# EAGLE design arduino_Uno_shield_bora_lora (EAGLE 7.4.0)
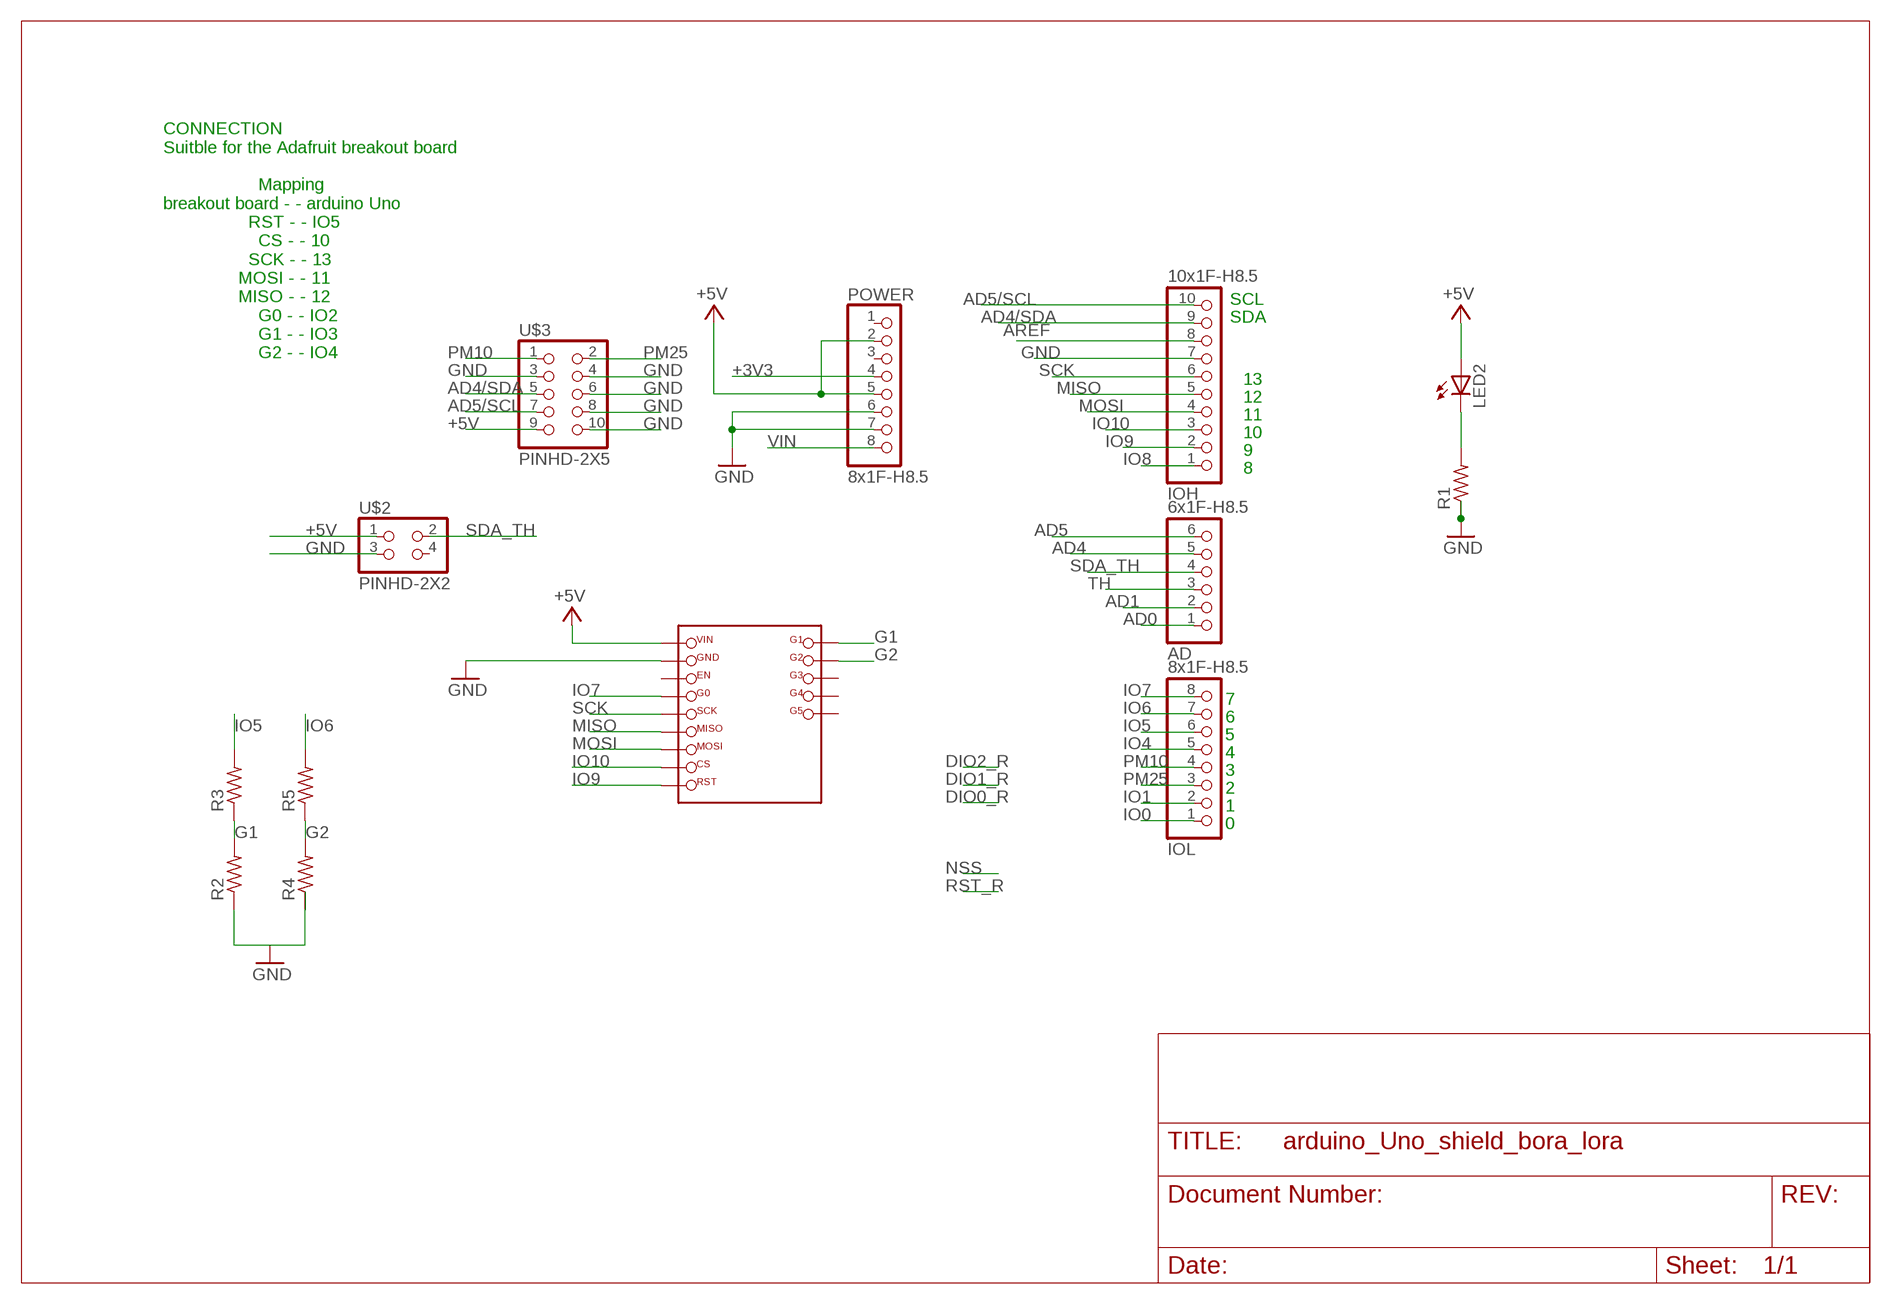
[diagram p0: schematic, sheet 1]

## Parts
AD  6x1F-H8.5  PINHD-1X6  [1X06]
IOH  10x1F-H8.5  PINHD-1X10_ARD  [1X10]
IOL  8x1F-H8.5  PINHD-1X8  [1X08]
LED2  LED3MM  [LED3MM]
POWER  8x1F-H8.5  PINHD-1X8  [1X08]
R1  RESISTOR1206  [1206]
R2  RESISTOR1206  [1206]
R3  RESISTOR1206  [1206]
R4  RESISTOR1206  [1206]
R5  RESISTOR1206  [1206]
U$1  RFM95W_ADAFRUIT  [RFM95W_ADAFRUIT]
U$2  PINHD-2X2  [2X2]
U$3  PINHD-2X5  [2X5]

## Nets
+3V3: POWER.4
+5V [usbvcc]: LED2.A POWER.2 POWER.5 U$1.VIN U$2.1 U$3.9
AD0: AD.1
AD1: AD.2
AD4: AD.5
AD4/SDA: IOH.9 U$3.5
AD5: AD.6
AD5/SCL: IOH.10 U$3.7
AREF [aref]: IOH.8
G1: R2.2 R3.1 U$1.G1
G2: R4.2 R5.1 U$1.G2
GND [gnd]: IOH.7 POWER.6 POWER.7 R1.1 R2.1 R4.1 U$1.GND U$2.3 U$3.3 U$3.4 U$3.6 U$3.8 U$3.10
IO0: IOL.1
IO1: IOL.2
IO4: IOL.5
IO5: IOL.6 R3.2
IO6: IOL.7 R5.2
IO7: IOL.8 U$1.G0
IO8: IOH.1
IO9: IOH.2 U$1.RST
IO10: IOH.3 U$1.CS
MISO: IOH.5 U$1.MISO
MOSI: IOH.4 U$1.MOSI
N$1: LED2.K(C) R1.2
PM10: IOL.4 U$3.1
PM25: IOL.3 U$3.2
SCK: IOH.6 U$1.SCK
SDA_TH: AD.4 U$2.2
TH: AD.3
VIN [power]: POWER.8
Unconnected: POWER.1 POWER.3 U$1.EN U$1.G3 U$1.G4 U$1.G5 U$2.4

## Notes on the sheet
- SCL
- SDA
- CONNECTION
  Suitble for the Adafruit breakout board
  
                     Mapping
  breakout board - - arduino Uno
                   RST - - IO5
                     CS - - 10 
                   SCK - - 13
                 MOSI - - 11
                 MISO - - 12
                     G0 - - IO2 
                     G1 - - IO3 
                     G2 - - IO4
- 13
- 12
- 11
- 10
- 9
- 8
- 7
- 6
- 5
- 4
- 3
- 2
- 1
- 0

## Library data of the parts
AD = SmartPrj:PINHD-1X6: PIN HEADER
IOH = SmartPrj:PINHD-1X10_ARD: PIN HEADER
IOL POWER = SmartPrj:PINHD-1X8: PIN HEADER
LED2 = led:LED: LED OSRAM: - CHIPLED LG R971, LG N971, LY N971, LG Q971, LY Q971, LO R971, LY R971 LH N974, LH R974 LS Q976, LO Q976, LY Q976 LO Q996 - Hyper CHIPLED LW Q18S LB Q993, LB Q99A, LB R99A - SideLED LS A670, LO A670, LY A670, LG A670, LP A670 LB A673, LV A673, LT A673, LW A673 LH A674 LY A675 LS A676, LA A676, LO A676, LY A676, LW A676 LS A679, LY A679, LG A679 - Hyper Micro SIDELED® LS Y876, LA Y876, LO Y876, LY Y876 LT Y87S - SmartLED LW L88C, LW L88S LB L89C, LB L89S, LG L890 LS L89K, LO L89K, LY L89K LS L896, LA L896, LO L896, LY L896 - TOPLED LS T670, LO T670, LY T670, LG T670, LP T670 LSG T670, LSP T670, LSY T670, LOP T670, LYG T670 LG T671, LOG T671, LSG T671 LB T673, LV T673, LT T673, LW T673 LH T674 LS T676, LA T676, LO T676, LY T676, LB T676, LH T676, LSB T676, LW T676 LB T67C, LV T67C, LT T67C, LS T67K, LO T67K, LY T67K, LW E67C LS E67B, LA E67B, LO E67B, LY E67B, LB E67C, LV E67C, LT E67C LW T67C LS T679, LY T679, LG T679 LS T770, LO T770, LY T770, LG T770, LP T770 LB T773, LV T773, LT T773, LW T773 LH T774 LS E675, LA E675, LY E675, LS T675 LS T776, LA T776, LO T776, LY T776, LB T776 LHGB T686 LT T68C, LB T68C - Hyper Mini TOPLED® LB M676 - Mini TOPLED Santana® LG M470 LS M47K, LO M47K, LY M47K Source: http://www.osram.convergy.de LUXEON: - LUMILED® LXK2-PW12-R00, LXK2-PW12-S00, LXK2-PW14-U00, LXK2-PW14-V00 LXK2-PM12-R00, LXK2-PM12-S00, LXK2-PM14-U00 LXK2-PE12-Q00, LXK2-PE12-R00, LXK2-PE12-S00, LXK2-PE14-T00, LXK2-PE14-U00 LXK2-PB12-K00, LXK2-PB12-L00, LXK2-PB12-M00, LXK2-PB14-N00, LXK2-PB14-P00, LXK2-PB14-Q00 LXK2-PR12-L00, LXK2-PR12-M00, LXK2-PR14-Q00, LXK2-PR14-R00 LXK2-PD12-Q00, LXK2-PD12-R00, LXK2-PD12-S00 LXK2-PH12-R00, LXK2-PH12-S00 LXK2-PL12-P00, LXK2-PL12-Q00, LXK2-PL12-R00 Source: www.luxeon.com KINGBRIGHT: KA-3528ASYC Source: www.kingbright.com
R1-R5 = ng:RESISTOR
U$1 = ep:RFM95W_ADAFRUIT
U$2 = ep:PINHD-2X2
U$3 = ep:PINHD-2X5

## Net classes
0 default: width 0.4 mm, drill 0.8 mm, clearance 0.8 mm
1 power: width 0.8 mm, drill 0.8 mm, clearance 0.8 mm
2 gnd: width 0.8 mm, drill 0.8 mm, clearance 0.8 mm
3 usbvcc: width 0.508 mm, drill 0.61 mm, clearance 0.254 mm
4 aref: width 0.406 mm, drill 0.61 mm, clearance 0.254 mm

## Board
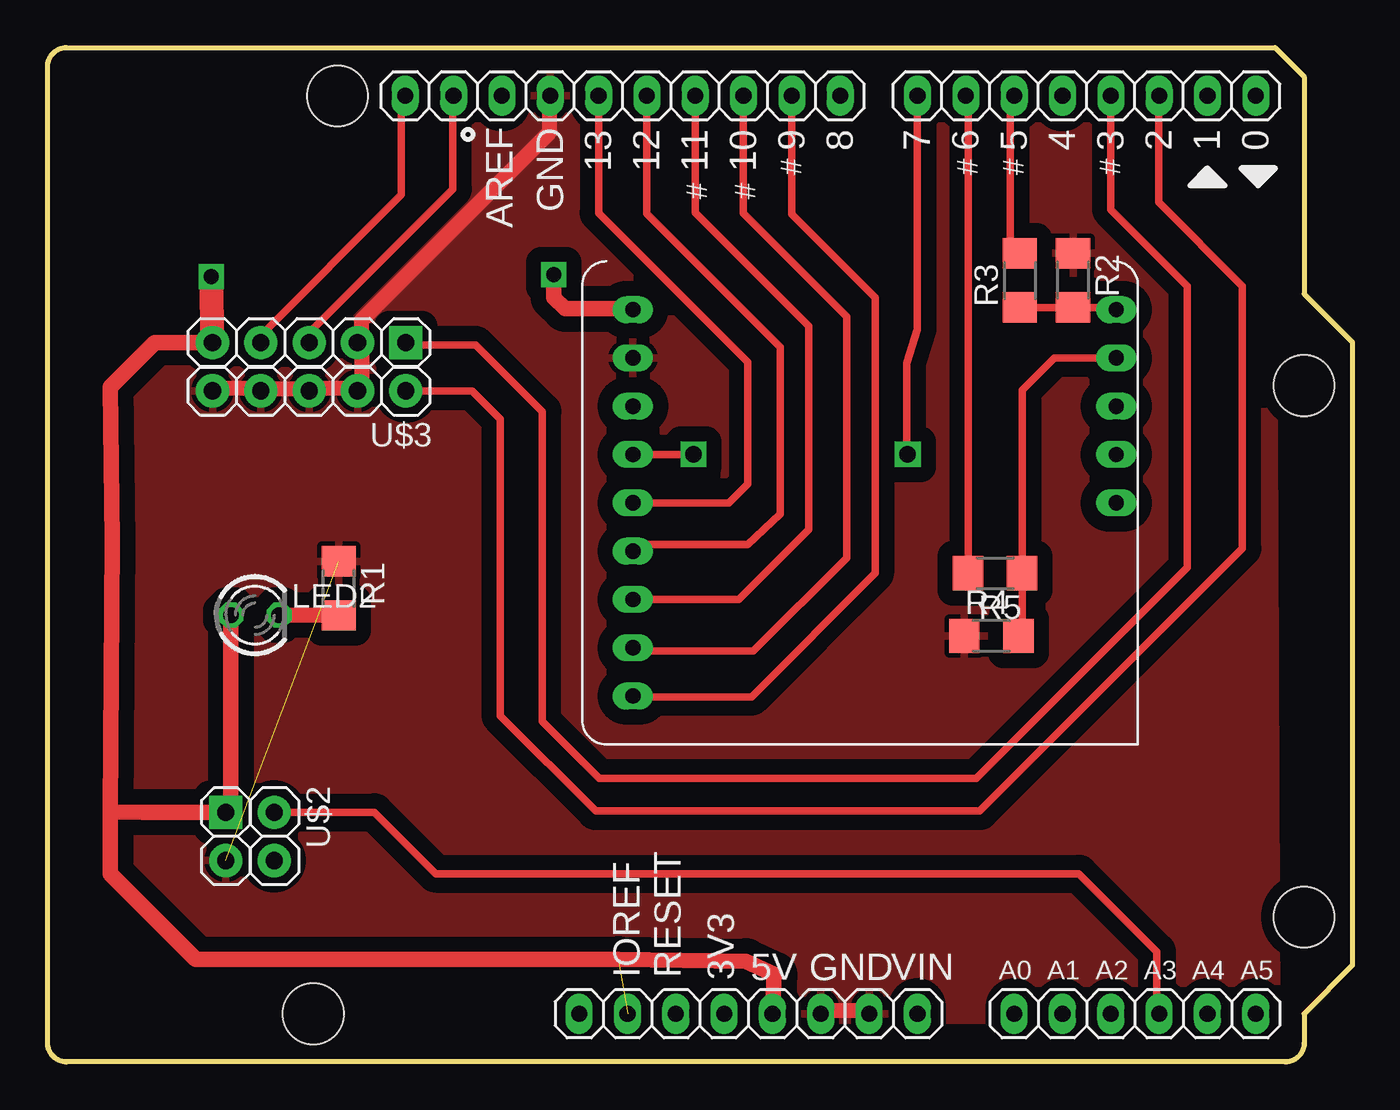
[diagram p1: board, top side]
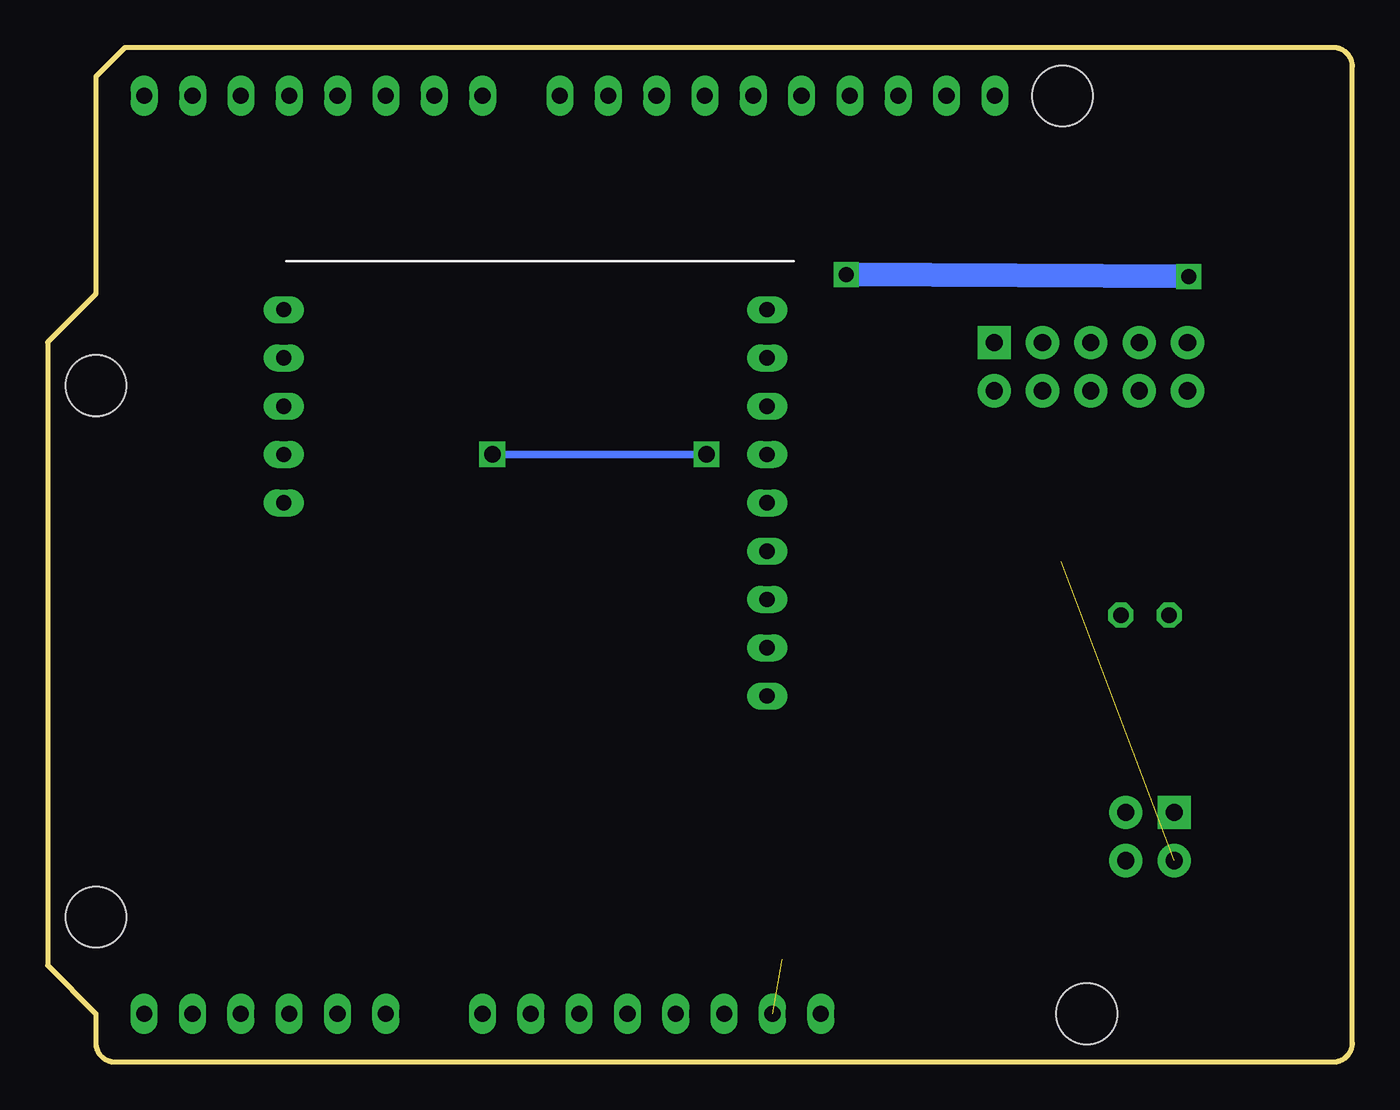
[diagram p2: board, bottom side, seen from below]

Size 68.58 x 53.34 mm. Coordinates in mm from the lower left corner, seen from the top.
Outline: 64.52,53.34 66.04,51.82 66.04,40.39 68.58,37.85 68.58,5.08 66.04,2.54 66.04,1 arc-90 65.04,0 1,0 arc-90 0,1 0,52.34 arc-90 1,53.34 64.52,53.34
Copper layers (1*16): Top 0.035mm / dielectric 1.5mm / Bottom 0.035mm
Design rules "drc_1_32inch": minimum track width 10mil, minimum drill 22mil, track to track 0.8mm, track to pad 0.8mm, pad to pad 0.8mm, via to via 0.8mm, smd to smd 0.8mm, copper to edge 26mil, drill to drill 12mil, minimum pad ring 10mil, minimum via ring 10mil, stop-mask expansion 1mil, vias tented up to drill 30mil, thermal gap 10mil
Holes 3.2 mm at 66.04,35.56 66.04,7.62 15.24,50.8 13.97,2.54

### Footprints (pad centres in the part's own frame; a part is rotated, then mirrored left to right if it is on the bottom)
1X06 = drill 0.85 pad 1.422 long: 1 -6.35,0; 2 -3.81,0; 3 -1.27,0; 4 1.27,0; 5 3.81,0; 6 6.35,0
1X10 = drill 0.85 pad 1.422 long: 1 -11.43,0; 2 -8.89,0; 3 -6.35,0; 4 -3.81,0; 5 -1.27,0; 6 1.27,0; 7 3.81,0; 8 6.35,0; 9 8.89,0; 10 11.43,0
1X08 = drill 0.85 pad 1.422 long: 1 -8.89,0; 2 -6.35,0; 3 -3.81,0; 4 -1.27,0; 5 1.27,0; 6 3.81,0; 7 6.35,0; 8 8.89,0
LED3MM = drill 0.813 octagon: A -1.27,0; K 1.27,0
1206 = smd 1.6 x 1.803: 1 -1.422,0; 2 1.422,0
RFM95W_ADAFRUIT = drill 0.8 pad 1.422 long: CS 2.667,5.08; EN 2.667,17.78; G0 2.667,15.24; G1 28.067,22.86; G2 28.067,20.32; G3 28.067,17.78; G4 28.067,15.24; G5 28.067,12.7; GND 2.667,20.32; MISO 2.667,10.16; MOSI 2.667,7.62; RST 2.667,2.54; SCK 2.667,12.7; VIN 2.667,22.86
2X2 = drill 0.9 pad 1.738 square: 1 1.27,1.27 | drill 0.9 pad 1.738: 2 1.27,3.81; 3 3.81,1.27; 4 3.81,3.81
2X5 = drill 0.9 pad 1.738 square: 1 1.27,1.27 | drill 0.9 pad 1.738: 2 1.27,3.81; 3 3.81,1.27; 4 3.81,3.81; 5 6.35,1.27; 6 6.35,3.81; 7 8.89,1.27; 8 8.89,3.81; 9 11.43,1.27; 10 11.43,3.81

### Placement (x,y rotation side)
AD  57.15,2.54 0 top
IOH  30.23,50.8 180 top
IOL  54.61,50.8 180 top
LED2  10.9,23.5 0 top
POWER  36.83,2.54 0 top
R1  15.3,24.9 270 top
R2  53.9,41.1 270 top
R3  51.1,41.1 90 top
R4  49.6,22.4 0 top
R5  49.8,25.7 180 top
U$1  28.1,16.7 0 top
U$2  8.1,14.4 270 top
U$3  20.1,39.1 180 top

### Tracks (layer width: path | path; a pad name or v marks a point on that pad's centre or on a via)
+5V  (via drill 0.8)  (1 unrouted)
  Top 0.813: U$3.9 5.63,37.83 3.3,35.5 3.4,27.4 3.3,13.14 | 3.3,13.14 5.01,13.13 U$2.1 9.63,13.39 LED2.A | 3.3,13.14 3.3,9.9 7.8,5.4 30,5.4 36.7,5.3 38.2,4.6 POWER.5 | v26.6,41.4 26.6,40.2 27.2,39.6 30.73,39.6 U$1.VIN
  Top 1.27: U$3.9 v8.6,41.3
  Bottom 1.27: v8.6,41.3 v26.6,41.4
AD4/SDA
  Top 0.4: IOH.9 21.3,50.7 21.3,45.9 13.5,38.1 U$3.5
AD5/SCL
  Top 0.4: IOH.10 18.6,50.7 18.6,45.6 11.1,38.1 U$3.7
G1
  Top 0.406: R3.1 R2.2 56.17,39.68 U$1.G1
G2
  Top 0.406: R4.2 51.22,22.4 R5.1 51.22,35.32 52.92,37.02 U$1.G2
GND  (1 unrouted)
  Top 0.8: POWER.6 41,2.7 42.9,2.7 POWER.7 | IOH.7 26.4,50.7 26.4,48.9 16.5,39 16.5,38.1 U$3.3 16.5,37.5 16.5,35.4 U$3.4 16.2,35.4 14.1,35.4 U$3.6 13.5,35.4 11.4,35.4 U$3.8 11.1,35.4 8.7,35.4 U$3.10 8.4,35.1
  pour Top: 2.4,51.8 2.6,2.2 64.6,2.2 64.4,51.8
IO5
  Top 0.406: IOL.6 50.6,50.8 50.6,42.8 51.1,42.8 R3.2
IO6
  Top 0.406: IOL.7 48.38,50.8 R5.2
IO7  (via drill 0.85)
  Top 0.406: U$1.G0 v33.95,31.94 v33.95,31.95 | IOL.8 45.72,38.52 45.15,36.75 45.15,31.95 v45.2,31.95
  Bottom 0.406: v33.95,31.95 v45.2,31.95
IO9
  Top 0.406: IOH.2 39.12,44.58 43.5,40.2 43.5,25.7 37,19.2 30.81,19.2 U$1.RST
IO10
  Top 0.406: IOH.3 36.58,44.62 42,39.2 42,26.5 37.1,21.6 30.95,21.6 U$1.CS
MISO
  Top 0.406: IOH.5 31.5,44.6 38.5,37.6 38.5,28.8 36.8,27.2 31.11,27.2 U$1.MISO
MOSI
  Top 0.406: IOH.4 34.04,44.66 40,38.7 40,28 36.32,24.32 U$1.MOSI
N$1
  Top 0.813: R1.2 LED2.K
PM10
  Top 0.406: IOL.4 55.88,44.82 59.9,40.8 59.9,26 48.8,14.9 29,14.9 26,17.9 26,34.2 22.5,37.7 18.96,37.7 U$3.1
PM25
  Top 0.406: U$3.2 22.31,35.29 23.8,33.8 23.8,18.2 28.8,13.2 49,13.2 62.8,27 62.8,40.8 58.4,45.2 58.4,50.78 IOL.3
SCK
  Top 0.406: IOH.6 28.96,44.64 36.8,36.8 36.8,30.4 35.8,29.4 U$1.SCK
SDA_TH
  Top 0.406: U$2.2 17.17,13.13 20.4,9.9 54.2,9.9 58.3,5.8 58.3,2.66 AD.4

### Text on the board
tPlace: 13 | 12 | 11 | 10 | 9 | 8 | 7 | 6 | 5 | 4 | 3 | 2 | 1 | 0
tNames: AREF | GND | # | # | # | # | # | # | IOREF | RESET | 3V3 | 5V | GND | VIN | A0 | A1 | A2 | A3 | A4 | A5
tTest: Released under the Creative Commons Attribution Share-Alike 4.0 Licence / https://creativecommons.org/licenses/by-sa/4.0/
Document: Designed by Emma Pareschi
214bmp: D:/SmartProjects/Snc/a4_bn_logo2.bmp